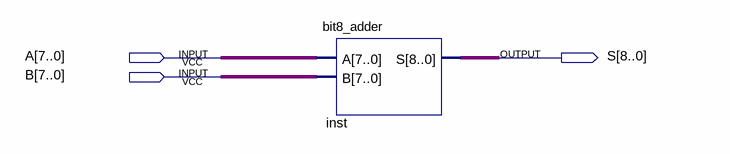
[diagram p0: schematic sheet]
// Quartus schematic adder.bdf as structural Verilog: 1 symbols, 3 pins
module adder (
  input  [7:0] A,
  input  [7:0] B,
  output [8:0] S
);

  bit8_adder inst (.A(A), .B(B), .S(S));
endmodule
